# EAGLE design SNES2GP (EAGLE 7.0.0)
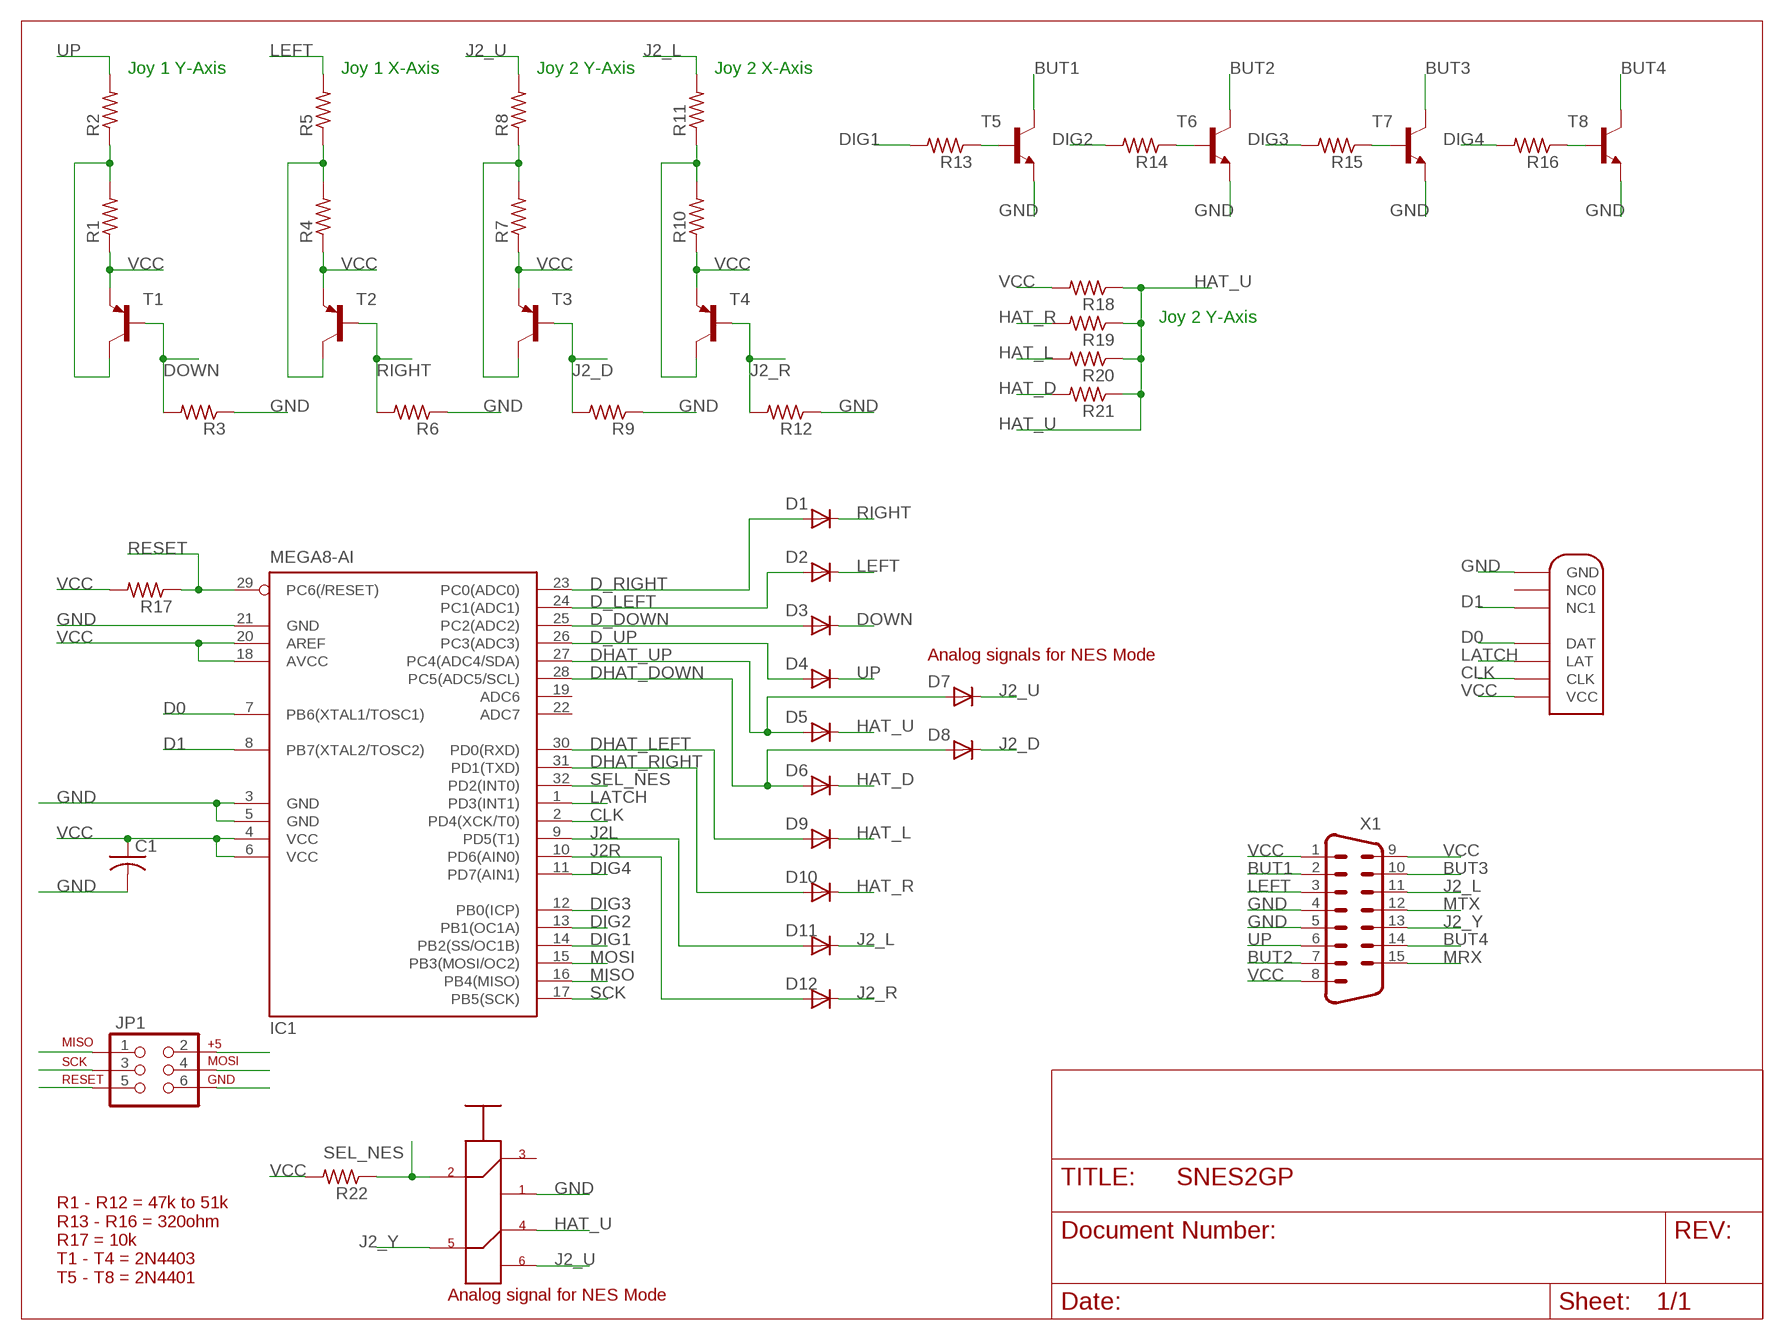
[diagram p0: schematic, sheet 1]

## Parts
C1  C-USC0805  [C0805]
D1  DIODE-SOD323-W  [SOD323-W]
D2  DIODE-SOD323-W  [SOD323-W]
D3  DIODE-SOD323-W  [SOD323-W]
D4  DIODE-SOD323-W  [SOD323-W]
D5  DIODE-SOD323-W  [SOD323-W]
D6  DIODE-SOD323-W  [SOD323-W]
D7  DIODE-SOD323-W  [SOD323-W]
D8  DIODE-SOD323-W  [SOD323-W]
D9  DIODE-SOD323-W  [SOD323-W]
D10  DIODE-SOD323-W  [SOD323-W]
D11  DIODE-SOD323-W  [SOD323-W]
D12  DIODE-SOD323-W  [SOD323-W]
IC1  MEGA8-AI  [TQFP32-08]
JP1  AVR_SPI_PRG_6NS  [2X3-NS]
R1  R-US_M0805  [M0805]
R2  R-US_M0805  [M0805]
R3  R-US_M0805  [M0805]
R4  R-US_M0805  [M0805]
R5  R-US_M0805  [M0805]
R6  R-US_M0805  [M0805]
R7  R-US_M0805  [M0805]
R8  R-US_M0805  [M0805]
R9  R-US_M0805  [M0805]
R10  R-US_M0805  [M0805]
R11  R-US_M0805  [M0805]
R12  R-US_M0805  [M0805]
R13  R-US_M0805  [M0805]
R14  R-US_M0805  [M0805]
R15  R-US_M0805  [M0805]
R16  R-US_M0805  [M0805]
R17  R-US_M0805  [M0805]
R18  R-US_M0805  [M0805]
R19  R-US_M0805  [M0805]
R20  R-US_M0805  [M0805]
R21  R-US_M0805  [M0805]
R22  R-US_M0805  [M0805]
T1  MMBT3906  [SOT23]
T2  MMBT3906  [SOT23]
T3  MMBT3906  [SOT23]
T4  MMBT3906  [SOT23]
T5  MMBT3904  [SOT23]
T6  MMBT3904  [SOT23]
T7  MMBT3904  [SOT23]
T8  MMBT3904  [SOT23]
U$1  7X7_SW  [7X7_SW]
U$3  SNES_GAMEPAD  [SNESCONN]
X1  M15HP  [M15HP]

## Nets
BUT1: T5.3(C) X1.2
BUT2: T6.3(C) X1.7
BUT3: T7.3(C) X1.10
BUT4: T8.3(C) X1.14
CLK: IC1.2(PD4(XCK/T0)) U$3.CLOCK(CLK)
D0: IC1.7(PB6(XTAL1/TOSC1)) U$3.DATA(DAT)
D1: IC1.8(PB7(XTAL2/TOSC2)) U$3.NC.(NC1)
D_DOWN: D3.A IC1.25(PC2(ADC2))
D_LEFT: D2.A IC1.24(PC1(ADC1))
D_RIGHT: D1.A IC1.23(PC0(ADC0))
D_UP: D4.A IC1.26(PC3(ADC3))
DHAT_DOWN: D6.A D8.A IC1.28(PC5(ADC5/SCL))
DHAT_LEFT: D9.A IC1.30(PD0(RXD))
DHAT_RIGHT: D10.A IC1.31(PD1(TXD))
DHAT_UP: D5.A D7.A IC1.27(PC4(ADC4/SDA))
DIG1: IC1.14(PB2(SS/OC1B)) R13.2
DIG2: IC1.13(PB1(OC1A)) R14.2
DIG3: IC1.12(PB0(ICP)) R15.2
DIG4: IC1.11(PD7(AIN1)) R16.2
DOWN: D3.C R3.2 T1.1(B)
GND: C1.2 IC1.3(GND) IC1.5(GND) IC1.21(GND) JP1.6 R3.1 R6.1 R9.1 R12.1 T5.2(E) T6.2(E) T7.2(E) T8.2(E) U$1.P$1 U$3.GND X1.4 X1.5
HAT_D: D6.C R21.2
HAT_L: D9.C R20.2
HAT_R: D10.C R19.2
HAT_U: D5.C R18.1 R19.1 R20.1 R21.1 U$1.P$4
J2_D: D8.C R9.2 T3.1(B)
J2_L: D11.C R11.2 X1.11
J2_R: D12.C R12.2 T4.1(B)
J2_U: D7.C R8.2 U$1.P$6
J2_Y: U$1.P$5 X1.13
J2L: D11.A IC1.9(PD5(T1))
J2R: D12.A IC1.10(PD6(AIN0))
LATCH: IC1.1(PD3(INT1)) U$3.LATCH(LAT)
LEFT: D2.C R5.2 X1.3
MISO: IC1.16(PB4(MISO)) JP1.1
MOSI: IC1.15(PB3(MOSI/OC2)) JP1.4
MRX: X1.15
MTX: X1.12
N$1: R13.1 T5.1(B)
N$2: R1.2 R2.1 T1.3(C)
N$3: R14.1 T6.1(B)
N$4: R4.2 R5.1 T2.3(C)
N$5: R15.1 T7.1(B)
N$6: R7.2 R8.1 T3.3(C)
N$7: R16.1 T8.1(B)
N$10: R10.2 R11.1 T4.3(C)
RESET: IC1.29(PC6(/RESET)) JP1.5 R17.1
RIGHT: D1.C R6.2 T2.1(B)
SCK: IC1.17(PB5(SCK)) JP1.3
SEL_NES: IC1.32(PD2(INT0)) R22.1 U$1.P$2
UP: D4.C R2.2 X1.6
VCC: C1.1 IC1.4(VCC) IC1.6(VCC) IC1.18(AVCC) IC1.20(AREF) JP1.2 R1.1 R4.1 R7.1 R10.1 R17.2 R18.2 R22.2 T1.2(E) T2.2(E) T3.2(E) T4.2(E) U$3.5V(VCC) X1.1 X1.8 X1.9
Unconnected: IC1.19(ADC6) IC1.22(ADC7) U$1.P$3 U$3.NC(NC0)

## Notes on the sheet
- Joy 1 Y-Axis | Joy 1 X-Axis | Joy 2 Y-Axis | Joy 2 X-Axis
- Joy 2 Y-Axis
- Analog signals for NES Mode
- R1 - R12 = 47k to 51k
  R13 - R16 = 320ohm
  R17 = 10k
  T1 - T4 = 2N4403
  T5 - T8 = 2N4401
- Analog signal for NES Mode

## Library data of the parts
C1 = rcl:C-US: CAPACITOR, American symbol
D1-D12 = diode:DIODE-: DIODE
IC1 = atmel:MEGA8: MICROCONTROLLER 8 Kbytes FLASH, 1 kbytes SRAM, 512 bytes EEPROM, USART, 6-channel 10 bit ADC, 2-channel 8 bit ADC Pin compatible with Atmega48, ATMega88, ATMega168 Source: avr.lbr; MPN: ATMEGA8-16AU; OC_FARNELL: 9171371; OC_NEWARK: 73M8863
JP1 = SparkFun-Connectors:AVR_SPI_PRG_6: AVR ISP 6 Pin This is the reduced ISP connector for AVR programming. Common on Arduino. This footprint will take up less PCB space and can be used with a 10-pin to 6-pin adapter such as SKU: BOB-08508 **Special note about "TEST_POINT" package. The stop mask is on the top side, so if you want your programming test points to be on the bottom of your board, make sure to place this package on the bottom side of the board. This also ensure that the orientation to program from the bottom side will be correct.
R1-R22 = rcl:R-US_: RESISTOR, American symbol
T1-T4 = transistor-pnp:MMBT3906
T5-T8 = transistor-npn:MMBT3904
U$1 = My_Parts_old+:7X7_SW
U$3 = SNES_Gamepad:SNES_GAMEPAD
X1 = con-subd:M15: SUB-D; OC_FARNELL: unknown; OC_NEWARK: unknown

## Board
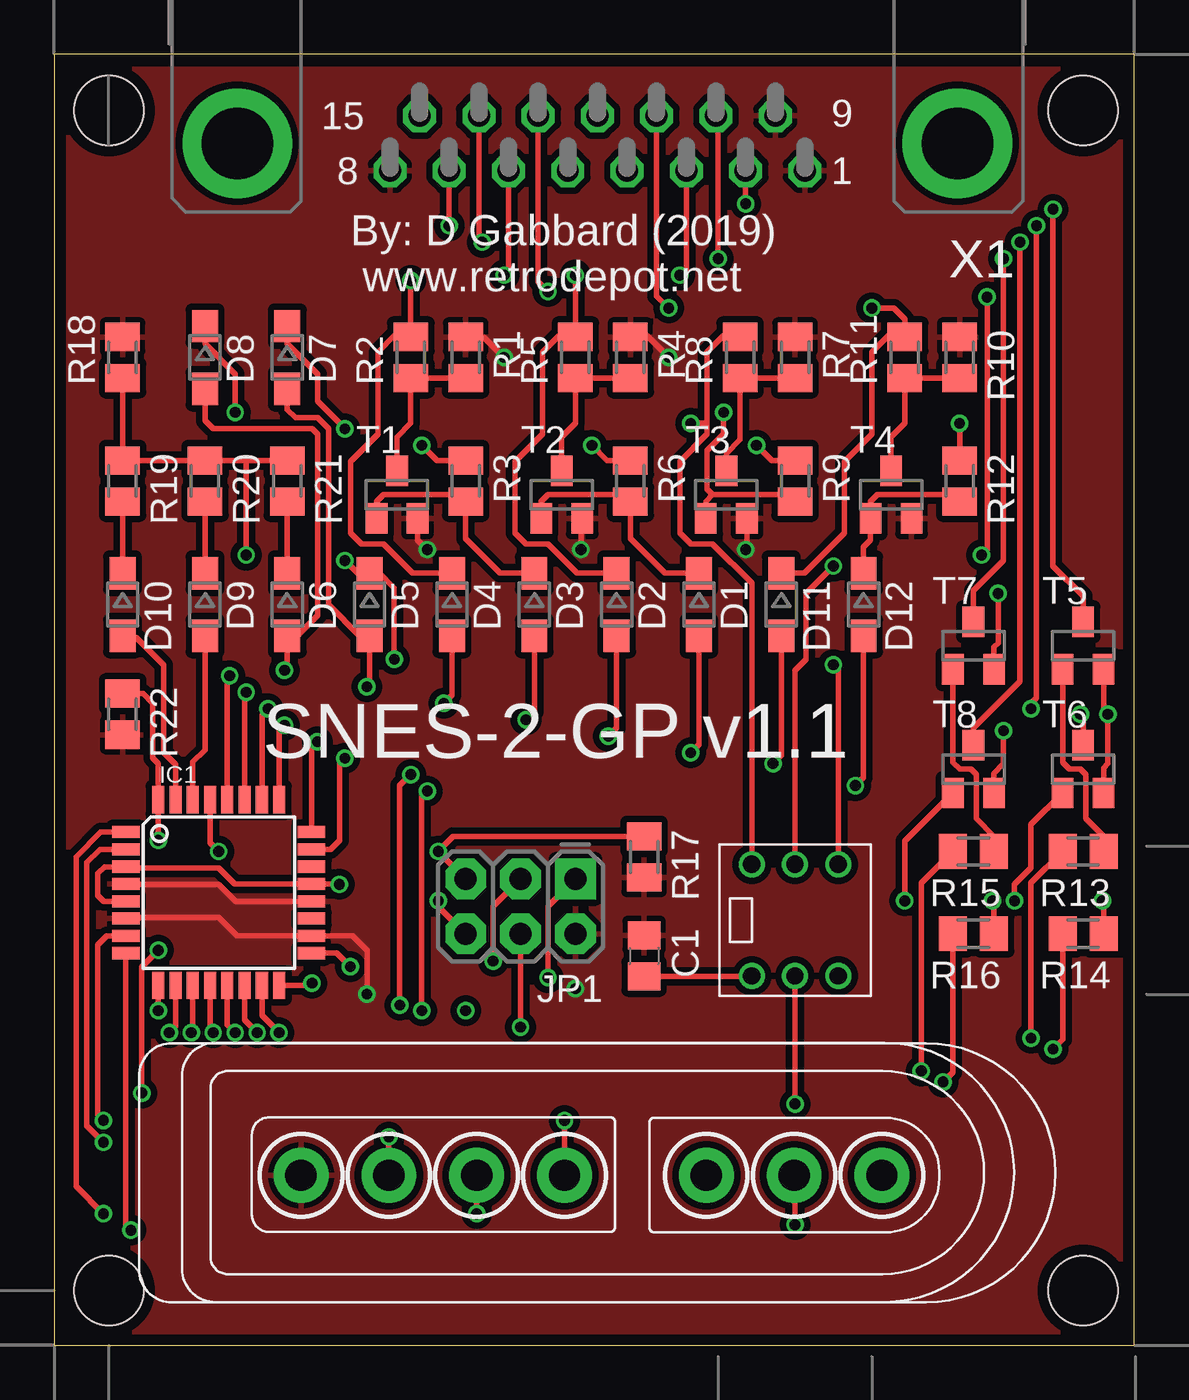
[diagram p1: board, top side]
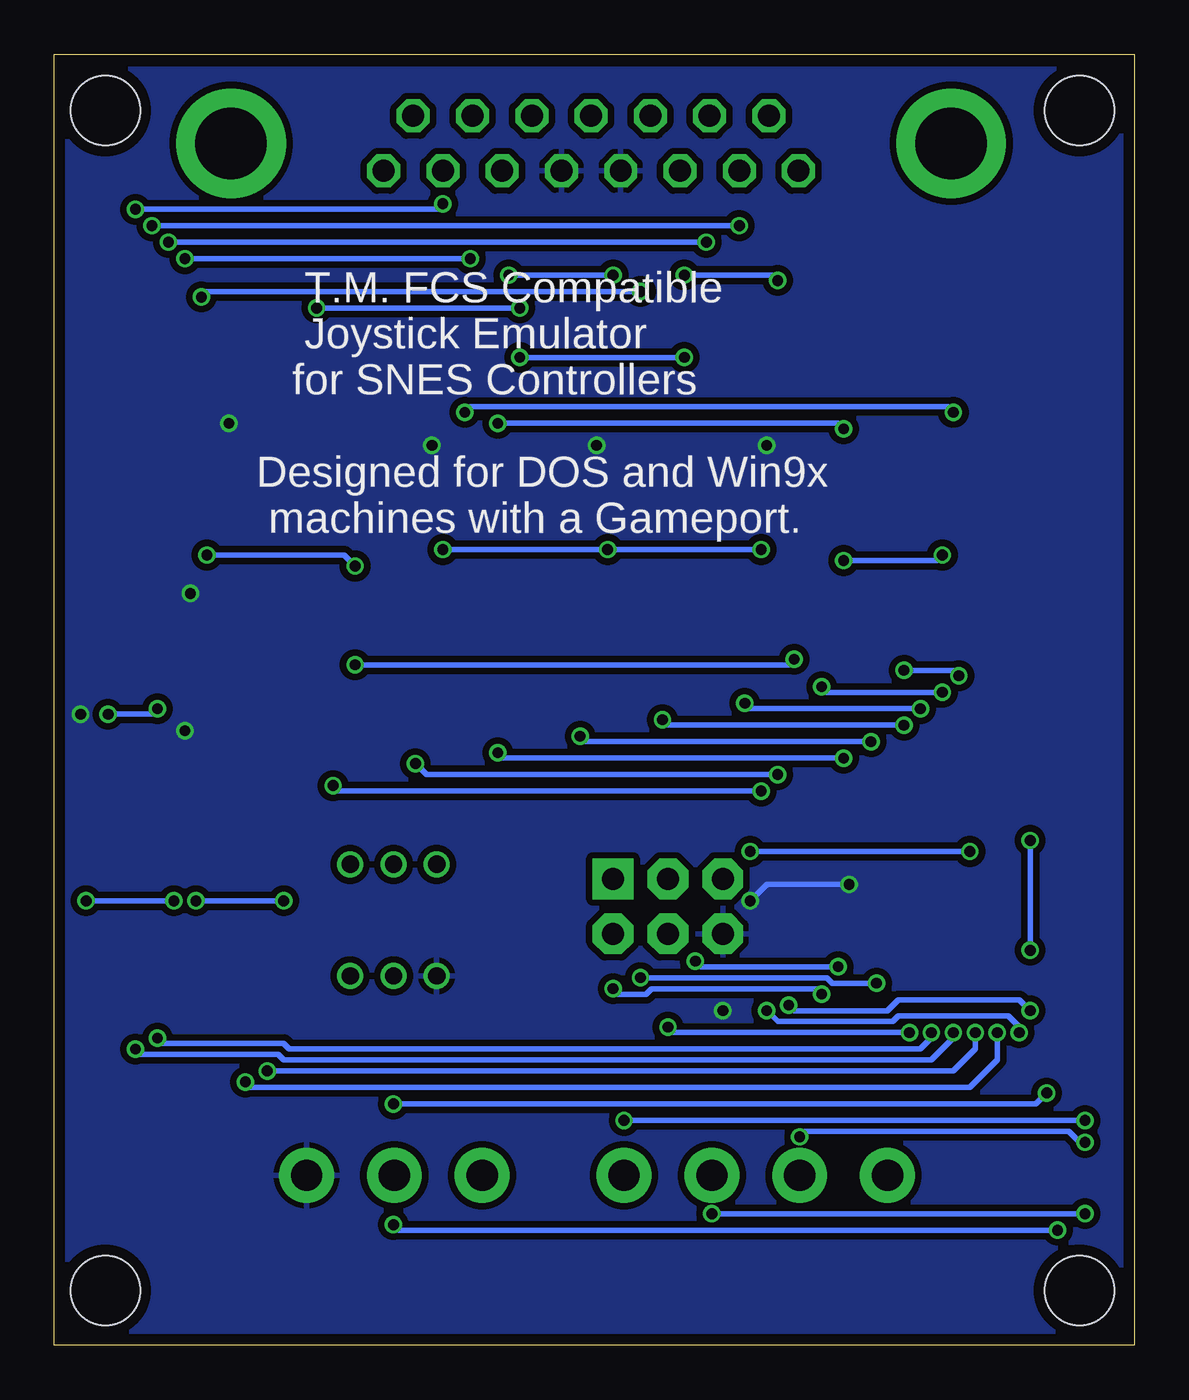
[diagram p2: board, bottom side, seen from below]

Size 50 x 59.76 mm. Coordinates in mm from the lower left corner, seen from the top.
Outline: 0,0 50,0 50,59.76 0,59.76 0,0
Copper layers (1*16): Top 0.035mm / dielectric 1.6mm / Bottom 0.035mm
Design rules "Elecrow_2-layer_PCB_eagle_rule": minimum track width 6mil, minimum drill 12mil, track to track 6mil, track to pad 6mil, pad to pad 6mil, via to via 8mil, smd to smd 0mil, copper to edge 20mil, drill to drill 10mil, minimum pad ring 6mil, minimum via ring 6mil, stop-mask expansion 0mil, vias tented up to drill 100mil, thermal gap 10mil
Holes 3.2 mm at 2.54,57.15 47.62,57.15 47.62,2.54 2.54,2.54

### Footprints (pad centres in the part's own frame; a part is rotated, then mirrored left to right if it is on the bottom)
C0805 = smd 1.3 x 1.5: 1 -0.95,0; 2 0.95,0
SOD323-W = smd 1.5 x 1.2: A 1.45,0; C -1.45,0
TQFP32-08 = smd 1.27 x 0.559: 1 -4.293,2.8; 2 -4.293,2; 3 -4.293,1.2; 4 -4.293,0.4; 5 -4.293,-0.4; 6 -4.293,-1.2; 7 -4.293,-2; 8 -4.293,-2.8; 17 4.293,-2.8; 18 4.293,-2; 19 4.293,-1.2; 20 4.293,-0.4; 21 4.293,0.4; 22 4.293,1.2; 23 4.293,2; 24 4.293,2.8 | smd 0.559 x 1.27: 9 -2.8,-4.293; 10 -2,-4.293; 11 -1.2,-4.293; 12 -0.4,-4.293; 13 0.4,-4.293; 14 1.2,-4.293; 15 2,-4.293; 16 2.8,-4.293; 25 2.8,4.293; 26 2,4.293; 27 1.2,4.293; 28 0.4,4.293; 29 -0.4,4.293; 30 -1.2,4.293; 31 -2,4.293; 32 -2.8,4.293
2X3-NS = drill 1.016 pad 1.88 square: 1 -2.54,-1.27 | drill 1.016 pad 1.88 octagon: 2 -2.54,1.27; 3 0,-1.27; 4 0,1.27; 5 2.54,-1.27; 6 2.54,1.27
M0805 = smd 1.3 x 1.6: 1 -0.95,0; 2 0.95,0
SOT23 = smd 1 x 1.4: 1 -0.95,-1.1; 2 0.95,-1.1; 3 0,1.1
7X7_SW = drill 0.8: P$1 -2,-2.58; P$2 0,-2.58; P$3 2,-2.58; P$4 2,2.58; P$5 0,2.58; P$6 -2,2.58
SNESCONN = drill 1.448 pad 2.54: 5V 0,4.064; CLOCK 4.064,4.064; DATA 12.192,4.064; GND 26.884,4.064; LATCH 8.128,4.064; NC 18.756,4.064; NC. 22.82,4.064
M15HP = drill 1.016 octagon: 1 -9.601,1.27; 2 -6.858,1.27; 3 -4.115,1.27; 4 -1.372,1.27; 5 1.372,1.27; 6 4.115,1.27; 7 6.858,1.27; 8 9.601,1.27; 9 -8.23,-1.27; 10 -5.486,-1.27; 11 -2.743,-1.27; 12 0,-1.27; 13 2.743,-1.27; 14 5.486,-1.27; 15 8.23,-1.27 | drill 3.302 pad 5.08: G1 -16.662,0; G2 16.662,0

### Placement (x,y rotation side)
C1  27.3,18.03 270 top
D1  29.84,34.29 270 top
D2  26.04,34.29 270 top
D3  22.23,34.29 270 top
D4  18.41,34.29 270 top
D5  14.61,34.29 270 top
D6  10.79,34.29 270 top
D7  10.79,45.72 270 top
D8  6.99,45.72 270 top
D9  6.99,34.29 270 top
D10  3.17,34.29 270 top
D11  33.66,34.29 270 top
D12  37.47,34.29 270 top
IC1  7.62,20.95 0 top
JP1  21.59,20.32 180 top
R1  19.05,45.72 270 top
R2  16.51,45.72 90 top
R3  19.05,40.01 270 top
R4  26.67,45.72 270 top
R5  24.13,45.72 90 top
R6  26.67,40.01 270 top
R7  34.29,45.72 270 top
R8  31.75,45.72 90 top
R9  34.29,40.01 270 top
R10  41.91,45.72 270 top
R11  39.37,45.72 90 top
R12  41.91,40.01 270 top
R13  47.62,22.86 180 top
R14  47.62,19.05 180 top
R15  42.55,22.86 180 top
R16  42.55,19.05 180 top
R17  27.3,22.61 270 top
R18  3.17,45.72 90 top
R19  3.17,40.01 270 top
R20  6.99,40.01 270 top
R21  10.79,40.01 270 top
R22  3.17,29.21 270 top
T1  15.88,39.37 0 top
T2  23.5,39.37 0 top
T3  31.11,39.37 0 top
T4  38.73,39.37 0 top
T5  47.62,32.38 0 top
T6  47.62,26.67 0 top
T7  42.55,32.38 0 top
T8  42.55,26.67 0 top
U$1  34.29,19.68 0 top
U$3  11.43,3.81 0 top
X1  25.15,55.63 180 top

### Tracks (layer width: path | path; a pad name or v marks a point on that pad's centre or on a via)
BUT1  (via drill 0.5)
  Top 0.254: T5.3 47.62,34.67 46.23,36.07 v46.23,52.58 | v32,52.83 X1.2
  Bottom 0.254: v46.23,52.58 32.26,52.58 v32,52.83
BUT2  (via drill 0.5)
  Top 0.254: T6.3 47.62,29.08 v47.5,29.21 | v45.21,29.46 45.21,29.72 45.47,29.97 v45.47,51.82 | X1.7 v18.29,51.82
  Bottom 0.254: v47.5,29.21 45.47,29.21 v45.21,29.46 | v45.47,51.82 v18.29,51.82
BUT3  (via drill 0.5)
  Top 0.254: T7.3 42.55,34.92 43.94,36.32 v43.94,50.29 | v30.73,50.29 30.73,56.79 X1.10
  Bottom 0.254: v43.94,50.29 v30.73,50.29
BUT4  (via drill 0.5)
  Top 0.254: T8.3 42.55,28.57 44.7,30.73 v44.7,51.05 | X1.14 19.66,51.21 v19.81,51.05
  Bottom 0.254: v44.7,51.05 v19.81,51.05
CLK  (via drill 0.5)
  Top 0.254: IC1.2 2.13,22.95 1.52,22.35 1.52,10.16 v2.29,9.4 | v15.49,9.65 U$3.CLOCK
  Bottom 0.254: v2.29,9.4 2.54,9.4 3.05,9.91 15.24,9.91 v15.49,9.65
D0  (via drill 0.5)
  Top 0.254: IC1.7 2.44,18.95 2.03,18.54 2.03,10.67 v2.29,10.41 | v23.62,10.41 U$3.DATA
  Bottom 0.254: v2.29,10.41 v23.62,10.41
D1  (via drill 0.5)
  Top 0.254: IC1.8 3.33,5.56 v3.56,5.33 | v34.29,5.59 34.29,7.83 U$3.NC.
  Bottom 0.254: v3.56,5.33 34.04,5.33 v34.29,5.59
D_DOWN  (via drill 0.5)
  Top 0.254: IC1.25 10.42,28.45 v10.67,28.7 | 22.1,29.21 v21.84,28.96 22.23,29.34 D3.A
  Bottom 0.254: v10.67,28.7 21.59,28.7 v21.84,28.96
D_LEFT  (via drill 0.5)
  Top 0.254: IC1.24 11.91,27.66 v12.19,27.94 | 25.91,28.45 v25.65,28.19 26.04,28.57 D2.A
  Bottom 0.254: v12.19,27.94 25.4,27.94 v25.65,28.19
D_RIGHT  (via drill 0.5)
  Top 0.254: IC1.23 12.79,22.95 13.21,23.37 13.21,26.92 v13.46,27.18 | 29.72,27.69 v29.46,27.43 29.84,27.81 D1.A
  Bottom 0.254: v13.46,27.18 29.21,27.18 v29.46,27.43
D_UP  (via drill 0.5)
  Top 0.254: IC1.26 9.62,29.18 v9.91,29.46 | 18.29,29.97 v18.03,29.72 18.41,30.1 D4.A
  Bottom 0.254: v9.91,29.46 17.78,29.46 v18.03,29.72
DHAT_DOWN  (via drill 0.5)
  Top 0.254: D8.A 6.99,42.8 7.37,42.42 11.94,42.42 12.19,42.16 12.19,33.78 11.25,32.84 D6.A 10.79,31.37 v10.67,31.24 | IC1.28 8.02,30.88 v8.13,30.99
  Bottom 0.254: v10.67,31.24 8.38,31.24 8.26,31.11 v8.13,30.99
DHAT_LEFT
  Top 0.254: D9.A 6.99,27.56 6.42,26.99 IC1.30
DHAT_RIGHT
  Top 0.254: IC1.31 5.62,26.89 5.08,27.43 5.08,31.5 3.81,32.77 3.25,32.77 D10.A
DHAT_UP  (via drill 0.5)
  Top 0.254: D7.A 10.79,43.31 11.18,42.93 12.19,42.93 12.7,42.42 12.7,34.29 14.15,32.84 D5.A 14.61,30.61 v14.48,30.48 | IC1.27 8.82,30.16 v8.89,30.23
  Bottom 0.254: v8.89,30.23 14.22,30.23 14.35,30.35 v14.48,30.48
DIG1  (via drill 0.5)
  Top 0.254: IC1.14 8.82,15.06 v9.4,14.48 | v45.21,14.22 45.21,21.4 R13.2
  Bottom 0.254: v9.4,14.48 9.4,14.22 9.91,13.72 39.12,13.72 39.37,13.97 44.96,13.97 v45.21,14.22
DIG2  (via drill 0.5)
  Top 0.254: IC1.13 8.02,14.84 v8.38,14.48 | 46.48,13.97 v46.23,13.72 46.67,14.16 R14.2
  Bottom 0.254: v8.38,14.48 8.38,14.22 9.4,13.21 39.37,13.21 39.62,13.46 45.97,13.46 v46.23,13.72
DIG3  (via drill 0.5)
  Top 0.254: IC1.12 7.22,14.62 v7.37,14.48 | v40.13,12.7 40.13,21.4 R15.2
  Bottom 0.254: v40.13,12.7 8.38,12.7 7.37,13.72 v7.37,14.48
DIG4  (via drill 0.5)
  Top 0.254: IC1.11 6.42,14.55 v6.35,14.48 | 41.4,12.45 v41.15,12.19 41.59,12.64 R16.2
  Bottom 0.254: v41.15,12.19 40.89,11.94 7.62,11.94 6.35,13.21 v6.35,14.48
DOWN
  Top 0.254: T1.1 14.93,39.05 15.24,39.37 18.54,39.37 18.86,39.05 R3.2 19.05,37.34 20.65,35.74 D3.C
GND  (via drill 0.5)
  Top 0.254: IC1.5 2.31,20.55 2.03,20.83 2.03,21.84 2.34,22.16 IC1.3 3.38,22.1 7.62,22.1 8.36,21.36 IC1.21 13.19,21.36 v13.21,21.34 | v17.78,20.57 17.78,20.32 JP1.6 | R3.1 17.72,40.95 v17.02,41.66 | R6.1 25.59,40.95 v24.89,41.66 | R9.1 33.21,40.95 v32.51,41.66 | T7.2 43.49,32.32 43.69,32.51 v43.69,34.8 | T8.2 43.49,26.48 43.94,26.92 v43.94,28.45 | T6.2 48.58,26.73 48.77,26.92 v48.77,29.21 48.58,29.4 T5.2 | v41.91,42.67 R12.1 | C1.2 32.27,17.08 U$1.P$1
  Bottom 0.254: v13.21,21.34 17.02,21.34 v17.78,20.57
  other vias: 19.05,15.49
  pour Bottom (isolate 0.305): 0.64,59.05 49.53,59.05 49.53,0.64 0.64,0.64
HAT_D
  Top 0.254: D6.C R21.2
HAT_L
  Top 0.254: D9.C R20.2
HAT_R
  Top 0.254: D10.C R19.2
HAT_U  (via drill 0.5)
  Top 0.254: R18.1 R19.1 R20.1 8.89,40.95 | R21.1 8.89,40.95 | v13.46,36.32 14.04,35.74 D5.C 14.68,35.81 14.99,35.81 15.75,35.05 v15.75,31.75 | v8.89,36.58 8.89,40.95 | U$1.P$4 36.29,31.27 v36.07,31.5
  Bottom 0.254: v13.46,36.32 9.14,36.32 v8.89,36.58 | v36.07,31.5 16,31.5 v15.75,31.75
J2_D  (via drill 0.5)
  Top 0.254: T3.1 30.16,39.05 30.48,39.37 | 30.48,39.37 33.98,39.37 R9.2 | D8.C 6.99,46.35 8.38,44.96 v8.38,43.18 | v30.99,43.18 30.99,42.16 30.23,41.4 30.23,39.62 30.48,39.37
  Bottom 0.254: v8.38,43.18 8.64,43.43 30.73,43.43 v30.99,43.18
J2_L  (via drill 0.5)
  Top 0.254: D11.C 34.72,35.74 36.58,37.59 36.58,40.89 37.85,42.16 37.85,45.97 38.61,46.74 39.3,46.74 R11.2 39.37,47.5 38.86,48.01 v37.85,48.01 | X1.11 27.89,48.56 v28.45,48.01
  Bottom 0.254: v28.45,48.01 v37.85,48.01
J2_R
  Top 0.254: R12.2 41.59,39.37 38.1,39.37 37.78,39.05 T4.1 37.78,37.28 37.47,36.96 D12.C
J2_U  (via drill 0.5)
  Top 0.254: U$1.P$6 32.29,35.27 30.48,37.08 29.46,37.08 28.96,37.59 28.96,40.89 30.23,42.16 30.23,42.67 | 30.23,42.67 30.23,45.97 30.99,46.74 31.68,46.74 R8.2 | D7.C 10.79,46.35 12.19,44.96 12.19,43.69 v13.46,42.42 | v29.46,42.67 30.23,42.67
  Bottom 0.254: v13.46,42.42 13.72,42.67 v29.46,42.67
J2_Y  (via drill 0.5)
  Top 0.254: v43.18,48.51 43.18,36.83 v42.93,36.58 | v36.07,36.07 34.8,34.8 34.8,31.75 34.29,31.24 U$1.P$5 | X1.13 22.4,49.23 v22.86,48.77
  Bottom 0.254: v22.86,48.77 42.93,48.77 v43.18,48.51 | v42.93,36.58 36.58,36.58 v36.07,36.07
J2L  (via drill 0.5)
  Top 0.254: IC1.9 v4.82,15.5 v4.83,15.49 | v16,15.75 16,25.91 v16.51,26.42 | 33.53,27.18 v33.27,26.92 33.66,27.3 D11.A
  Bottom 0.254: v16.51,26.42 32.77,26.42 v33.27,26.92 | v4.83,15.49 5.33,16 10.92,16 11.43,15.49 15.75,15.49 v16,15.75
J2R  (via drill 0.5)
  Top 0.254: v17.02,15.49 17.02,25.4 v17.27,25.65 | 37.34,26.16 v37.08,25.91 37.47,26.29 D12.A | IC1.10 5.62,14.76 v5.33,14.48
  Bottom 0.254: v17.02,15.49 16.51,14.99 11.18,14.99 10.92,15.24 5.84,15.24 5.33,14.73 v5.33,14.48 | v17.27,25.65 36.83,25.65 v37.08,25.91
LATCH  (via drill 0.5)
  Top 0.254: IC1.1 2.17,23.75 1.02,22.61 1.02,7.37 v2.29,6.1 | v19.56,6.1 U$3.LATCH
  Bottom 0.254: v2.29,6.1 v19.56,6.1
LEFT  (via drill 0.5)
  Top 0.254: 24.06,46.74 23.37,46.74 22.61,45.97 22.61,42.16 21.34,40.89 21.34,37.59 21.84,37.08 22.86,37.08 24.2,35.74 D2.C | 24.06,46.74 R5.2 | 24.06,46.74 24.13,46.74 v24.13,49.53 | 29.21,49.78 v28.96,49.53 29.26,49.84 X1.3
  Bottom 0.254: v24.13,49.53 v28.96,49.53
MISO  (via drill 0.5)
  Top 0.254: IC1.16 11.84,16.66 v11.94,16.76 | v22.86,17.02 22.86,20.32 JP1.1
  Bottom 0.254: v11.94,16.76 13.97,16.76 14.22,17.02 v22.86,17.02
MOSI  (via drill 0.5)
  Top 0.254: v21.59,14.73 JP1.4 | IC1.15 9.62,15.27 v10.41,14.48
  Bottom 0.254: v10.41,14.48 21.34,14.48 v21.59,14.73
N$1
  Top 0.254: R13.1 48.58,23.56 47.75,24.38 47.75,26.42 47.5,26.67 46.99,26.67 46.67,26.98 T5.1
N$2
  Top 0.254: T1.3 15.88,42.04 16.51,42.67 R2.1 R1.2
N$3  (via drill 0.5)
  Top 0.254: R14.1 48.58,20.51 v48.51,20.57 | v44.45,20.57 44.45,21.34 45.21,22.1 45.21,24.11 T6.1
  Bottom 0.254: v48.51,20.57 v44.45,20.57
N$4
  Top 0.254: T2.3 23.5,42.04 24.13,42.67 R5.1 R4.2
N$5
  Top 0.254: R15.1 43.49,23.56 42.67,24.38 42.67,26.42 42.42,26.67 41.91,26.67 41.59,26.98 T7.1
N$6
  Top 0.254: T3.3 31.11,41.27 31.75,41.91 R8.1 R7.2
N$7  (via drill 0.5)
  Top 0.254: R16.1 43.49,20.51 v43.43,20.57 | v39.37,20.57 39.37,23.34 T8.1
  Bottom 0.254: v43.43,20.57 v39.37,20.57
N$10
  Top 0.254: T4.3 38.73,42.04 39.37,42.67 R11.1 R10.2
RESET  (via drill 0.5)
  Top 0.254: JP1.5 v17.78,22.86 18.48,23.56 R17.1 | 7.37,23.11 v7.62,22.86 7.22,23.26 IC1.29
  Bottom 0.254: v17.78,22.86 v7.62,22.86
RIGHT
  Top 0.254: T2.1 22.55,39.05 22.86,39.37 26.36,39.37 R6.2 26.67,37.34 28.27,35.74 D1.C
SCK  (via drill 0.5)
  Top 0.254: IC1.17 13.09,18.16 v13.72,17.53 | v20.32,17.78 20.32,20.32 JP1.3
  Bottom 0.254: v13.72,17.53 20.07,17.53 v20.32,17.78
SEL_NES  (via drill 0.5)
  Top 0.254: R22.1 4.13,30.16 4.57,29.72 4.57,27.18 4.82,26.93 IC1.32 v4.83,23.37 | U$1.P$2 v34.29,11.18 | v4.06,11.68 4.06,17.53 v4.83,18.29
  Bottom 0.254: v34.29,11.18 4.57,11.18 v4.06,11.68 | v4.83,18.29 v4.83,23.37
UP  (via drill 0.5)
  Top 0.254: v16.51,49.28 R2.2 16.44,46.74 15.75,46.74 14.99,45.97 14.99,42.16 13.72,40.89 13.72,37.59 14.22,37.08 15.24,37.08 16.58,35.74 D4.C | X1.6 21.03,49.73 v20.83,49.53
  Bottom 0.254: v20.83,49.53 16.76,49.53 v16.51,49.28
VCC  (via drill 0.5)
  Top 0.254: IC1.20 8.4,20.55 7.62,21.34 3.35,21.34 IC1.4 | IC1.6 3.38,19.81 7.62,19.81 8.48,18.95 IC1.18 13.81,18.95 14.48,18.29 v14.48,16.26 | T1.2 16.82,37.28 v17.27,36.83 | v24.38,36.83 24.38,38.21 T2.2 | T3.2 32.06,36.89 v32,36.83 | R1.1 19.88,46.67 v20.83,45.72 | v28.45,45.72 27.43,46.74 26.74,46.74 R4.1
  Bottom 0.254: v14.48,16.26 14.73,16.51 22.35,16.51 22.61,16.26 23.88,16.26 v24.13,16.51 | v17.27,36.83 v24.38,36.83 v32,36.83 | v20.83,45.72 v28.45,45.72
  pour Top (isolate 0.305): 0.64,59.05 49.53,59.05 49.53,0.64 0.64,0.64

### Text on the board
tPlace: By: D Gabbard (2019) / www.retrodepot.net | SNES-2-GP v1.1
bPlace: T.M. FCS Compatible / Joystick Emulator / for SNES Controllers / / Designed for DOS and Win9x / machines with a Gameport.